# Altium schematic sheet Peltier_activation_board.SchDoc
size A4
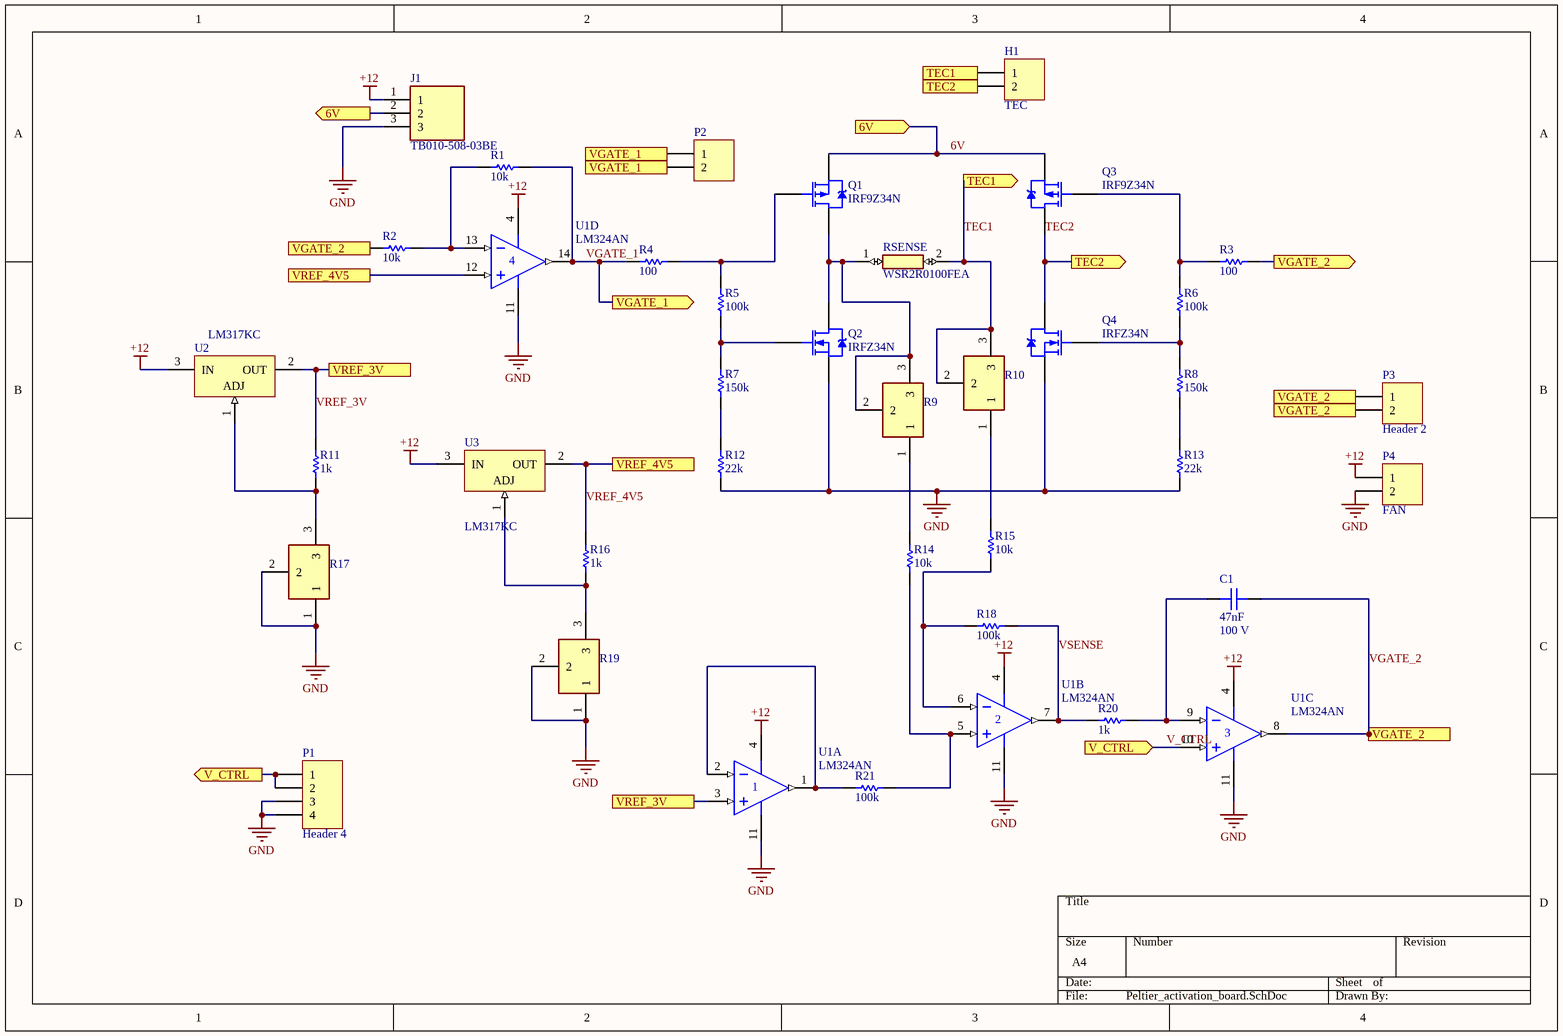
[diagram p0: Peltier_activation_board.SchDoc]

## Parts
C1  value 47nF  Voltage: 100 V  [C100-200-100]  (hidden comment: Capacitor)
H1  TEC  [TB02]
J1  TB010-508-03BE  [TB01050803BE]
P1  Header 4  [HDR1X4]
P2  (no value)  [HDR1X2]
P3  Header 2  [HDR1X2]
P4  FAN  [HDR1X2]
Q1  IRF9Z34N  [TO-220AB]
Q2  IRFZ34N  [TO-220AB]
Q3  IRF9Z34N  [TO-220AB]
Q4  IRFZ34N  [TO-220AB]
R1  value 10k  [R400-2.0mm]  (hidden comment: Resistor)
R2  value 10k  [R400-2.0mm]  (hidden comment: Resistor)
R3  value 100  [R400-2.0mm]  (hidden comment: Resistor)
R4  value 100  [R400-2.0mm]  (hidden comment: Resistor)
R5  value 100k  [R400-2.0mm]  (hidden comment: Resistor)
R6  value 100k  [R400-2.0mm]  (hidden comment: Resistor)
R7  value 150k  [R400-2.0mm]  (hidden comment: Resistor)
R8  value 150k  [R400-2.0mm]  (hidden comment: Resistor)
R9  3006P-1-103LF  [3006P_1]  (value not drawn)
R10  3006P-1-103LF  [3006P_1]  (value not drawn)
R11  value 1k  [R400-2.0mm]  (hidden comment: Resistor)
R12  value 22k  [R400-2.0mm]  (hidden comment: Resistor)
R13  value 22k  [R400-2.0mm]  (hidden comment: Resistor)
R14  value 10k  [R400-2.0mm]  (hidden comment: Resistor)
R15  value 10k  [R400-2.0mm]  (hidden comment: Resistor)
R16  value 1k  [R400-2.0mm]  (hidden comment: Resistor)
R17  3006P-1-103LF  [3006P_1]  (value not drawn)
R18  value 100k  [R400-2.0mm]  (hidden comment: Resistor)
R19  3006P-1-103LF  [3006P_1]  (value not drawn)
R20  value 1k  [R400-2.0mm]  (hidden comment: Resistor)
R21  value 100k  [R400-2.0mm]  (hidden comment: Resistor)
RSENSE  WSR2R0100FEA  [RESM11670X254N]
U1  LM324AN  [N014]  (parts A,B,C,D of 4)
U2  LM317KC  [KC03]
U3  LM317KC  [KC03]

## Ports
6V (in), 6V (out), TEC1 (in), TEC1 (out), TEC2 (in), TEC2 (out), V_CTRL (in), V_CTRL (out), VGATE_1 (out), VGATE_2, VGATE_2 (out), VREF_3V, VREF_4V5

## Nets
+12: J1.1 P4.1 U1.4(V+) U2.3(IN) U3.3(IN)
GND: J1.3 P1.3 P1.4 P4.2 Q2.3(S) Q4.3(S) R12.2 R13.2 R17.1 R17.2 R19.1 R19.2 U1.11(V-)
6V: J1.2 Q1.3(S) Q3.3(S) ; port 6V
TEC1: H1.1 R10.2 R10.3 RSENSE.2 ; port TEC1
TEC2: H1.2 Q3.2(D) Q4.2(D) ; port TEC2
V_CTRL: P1.1 P1.2 U1.10(IN+) ; port V_CTRL
VGATE_1: P2.1 P2.2 R1.1 R4.2 U1.14(OUT) ; port VGATE_1
VGATE_2: C1.2 P3.1 P3.2 R2.2 R3.1 U1.8(OUT) ; port VGATE_2
VREF_3V: R11.2 U1.3(IN+) U2.2(OUT) ; port VREF_3V
VREF_4V5: R16.2 U1.12(IN+) U3.2(OUT) ; port VREF_4V5
VSENSE: R18.2 R20.1 U1.7(OUT)
NetC1_1: C1.1 R20.2 U1.9(IN-)
NetQ1_1: Q1.1(G) R4.1 R5.1
NetQ1_2: Q1.2(D) Q2.2(D) R9.2 R9.3 RSENSE.1
NetQ2_1: Q2.1(G) R5.2 R7.1
NetQ3_1: Q3.1(G) R3.2 R6.1
NetQ4_1: Q4.1(G) R6.2 R8.1
NetR1_2: R1.2 R2.1 U1.13(IN-)
NetR7_2: R7.2 R12.1
NetR8_2: R8.2 R13.1
NetR9_1: R9.1 R14.2
NetR10_1: R10.1 R15.2
NetR11_1: R11.1 R17.3 U2.1(ADJ)
NetR14_1: R14.1 R21.2 U1.5(IN+)
NetR15_1: R15.1 R18.1 U1.6(IN-)
NetR16_1: R16.1 R19.3 U3.1(ADJ)
NetR21_1: R21.1 U1.1(OUT) U1.2(IN-)

## Library data of the parts
H1 = Terminal_1x2: Bloco terminal 1x2
J1 = TB010-508-03BE: Connector; Manufacturer_Name: CUI Inc.; Datasheet Link: https://componentsearchengine.com/Datasheets/1/TB010-508-03BE.pdf; Height: 18.2mm; Manufacturer_Part_Number: TB010-508-03BE; Mouser Part Number: 490-TB010-508-03BE; Mouser Price/Stock: https://www.mouser.co.uk/ProductDetail/CUI-Devices/TB010-508-03BE?qs=vLWxofP3U2z1pw1VuAsf2Q%3D%3D; Arrow Part Number: TB010-508-03BE; Arrow Price/Stock: https://www.arrow.com/en/products/tb010-508-03be/cui-devices?region=nac
P1 = Header 4: Header, 4-Pin; LatestRevisionDate: 17-Jul-2002; LatestRevisionNote: Re-released for DXP Platform.; Publisher: Altium Limited
P2-P4 = Header 2: Header, 2-Pin; LatestRevisionDate: 17-Jul-2002; LatestRevisionNote: Re-released for DXP Platform.; Publisher: Altium Limited
Q1 Q3 = IRF9Z34N: HEXFET Power MOSFET; Note: Pin 2 is electrically connected to pin 4.; Published: 8-Jun-2000; LatestRevisionDate: 17-Jul-2002; LatestRevisionNote: Re-released for DXP Platform.; DatasheetVersion: Aug-1997; PackageVersion: Feb-1997; PackageReference: TO-220AB; Publisher: Altium Limited; PackageDescription: TO, Thru-Hole, Vertical, Heatsink Mounted; 3 In-Line Leads; Pitch 2.54 mm; ComponentLink1Description: Manufacturer Link; ComponentLink1URL: http://www.irf.com/; ComponentLink2Description: Datasheet; ComponentLink2URL: http://www.irf.com/product-info/datasheets/data/irf9z34n.pdf
Q2 Q4 = IRFZ34N: HEXFET Power MOSFET; Note: Pin 2 is electrically connected to pin 4.; Published: 8-Jun-2000; LatestRevisionDate: 17-Jul-2002; LatestRevisionNote: Re-released for DXP Platform.; DatasheetVersion: Aug-1997; PackageVersion: Feb-1997; PackageReference: TO-220AB; Publisher: Altium Limited; PackageDescription: TO, Thru-Hole, Vertical, Heatsink Mounted; 3 In-Line Leads; Pitch 2.54 mm; ComponentLink1Description: Manufacturer Link; ComponentLink1URL: http://www.irf.com/; ComponentLink2Description: Datasheet; ComponentLink2URL: http://www.irf.com/product-info/datasheets/data/irfz34n.pdf
R1-R8 R11-R16 R18 R20 R21 = Resistor: Power: 1/8 W; Tolerance: 5%; Published: 8-Jun-2000; LatestRevisionDate: 17-Jul-2002; LatestRevisionNote: Re-released for DXP Platform.; PackageReference: AXIAL-0.3; Publisher: Altium Limited
R9 R10 R17 R19 = 3006P-1-103LF: Resistor; Manufacturer_Name: Bourns; Datasheet Link: http://www.bourns.com/docs/Product-Datasheets/3006.pdf; Manufacturer_Part_Number: 3006P-1-103LF; Mouser Part Number: 652-3006P-1-103-LF; Mouser Price/Stock: https://www.mouser.co.uk/ProductDetail/Bourns/3006P-1-103LF?qs=nlUCIKN74UBewXtW9dljOA%3D%3D; Arrow Part Number: 3006P-1-103LF; Arrow Price/Stock: https://www.arrow.com/en/products/3006p-1-103lf/bourns
RSENSE = WSR2R0100FEA: Resistor; Manufacturer_Name: Vishay; Datasheet Link: https://rs.componentsearchengine.com/Datasheets/2/WSR2R0100FEA.pdf; Height: 2.537mm; Manufacturer_Part_Number: WSR2R0100FEA; Mouser Part Number: 71-WSR2R0100FEA; Mouser Price/Stock: https://www.mouser.com/Search/Refine.aspx?Keyword=71-WSR2R0100FEA; Arrow Part Number: WSR2R0100FEA; Arrow Price/Stock: https://www.arrow.com/en/products/wsr2r0100fea/vishay
U1 = LM324AN: Quadruple Operational Amplifier; Published: 15-Apr-2002; LatestRevisionDate: 04-Mar-2005; LatestRevisionNote: Stylized 3D Model Added.; DatasheetVersion: Jan-1989; PackageVersion: Oct-1995; PackageReference: N014; Publisher: Altium Limited; PackageDescription: DIP; 14 Leads; Row Spacing 7.62 mm; Pitch 2.54 mm; ComponentLink1Description: Manufacturer Link; ComponentLink1URL: http://www.ti.com/; ComponentLink2Description: Datasheet; ComponentLink2URL: http://www-s.ti.com/sc/ds/lm324.pdf
U2 U3 = LM317KC: 3-Terminal Adjustable Regulator; Note: Pin 2 is electrically connected to tab; Published: 15-Apr-2002; DatasheetVersion: Feb-1988; PackageVersion: Sep-1995; PackageReference: KC03; Publisher: Altium Limited; PackageDescription: TO, Thru-Hole, Vertical, Heatsink Mounted; 3 In-Line Leads; Pitch 2.54 mm; ComponentLink1Description: Manufacturer Link; ComponentLink1URL: http://www.ti.com/
C1 = Capacitor: Published: 8-Jun-2000; LatestRevisionDate: 17-Jul-2002; LatestRevisionNote: Re-released for DXP Platform.; PackageReference: RAD-0.3; Publisher: Altium Limited